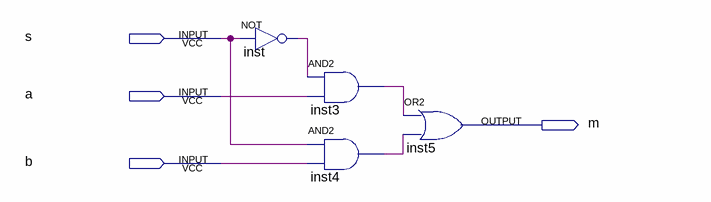
[diagram p0: schematic sheet]
// Quartus schematic MUX2_1_1BIT.bdf as structural Verilog: 4 symbols, 4 pins
module MUX2_1_1BIT (
  input  s,
  input  a,
  input  b,
  output m
);

  wire inst3_out, inst4_out, inst_out;

  not inst (inst_out, s);
  and inst3 (inst3_out, inst_out, a);
  and inst4 (inst4_out, s, b);
  or inst5 (m, inst3_out, inst4_out);
endmodule
